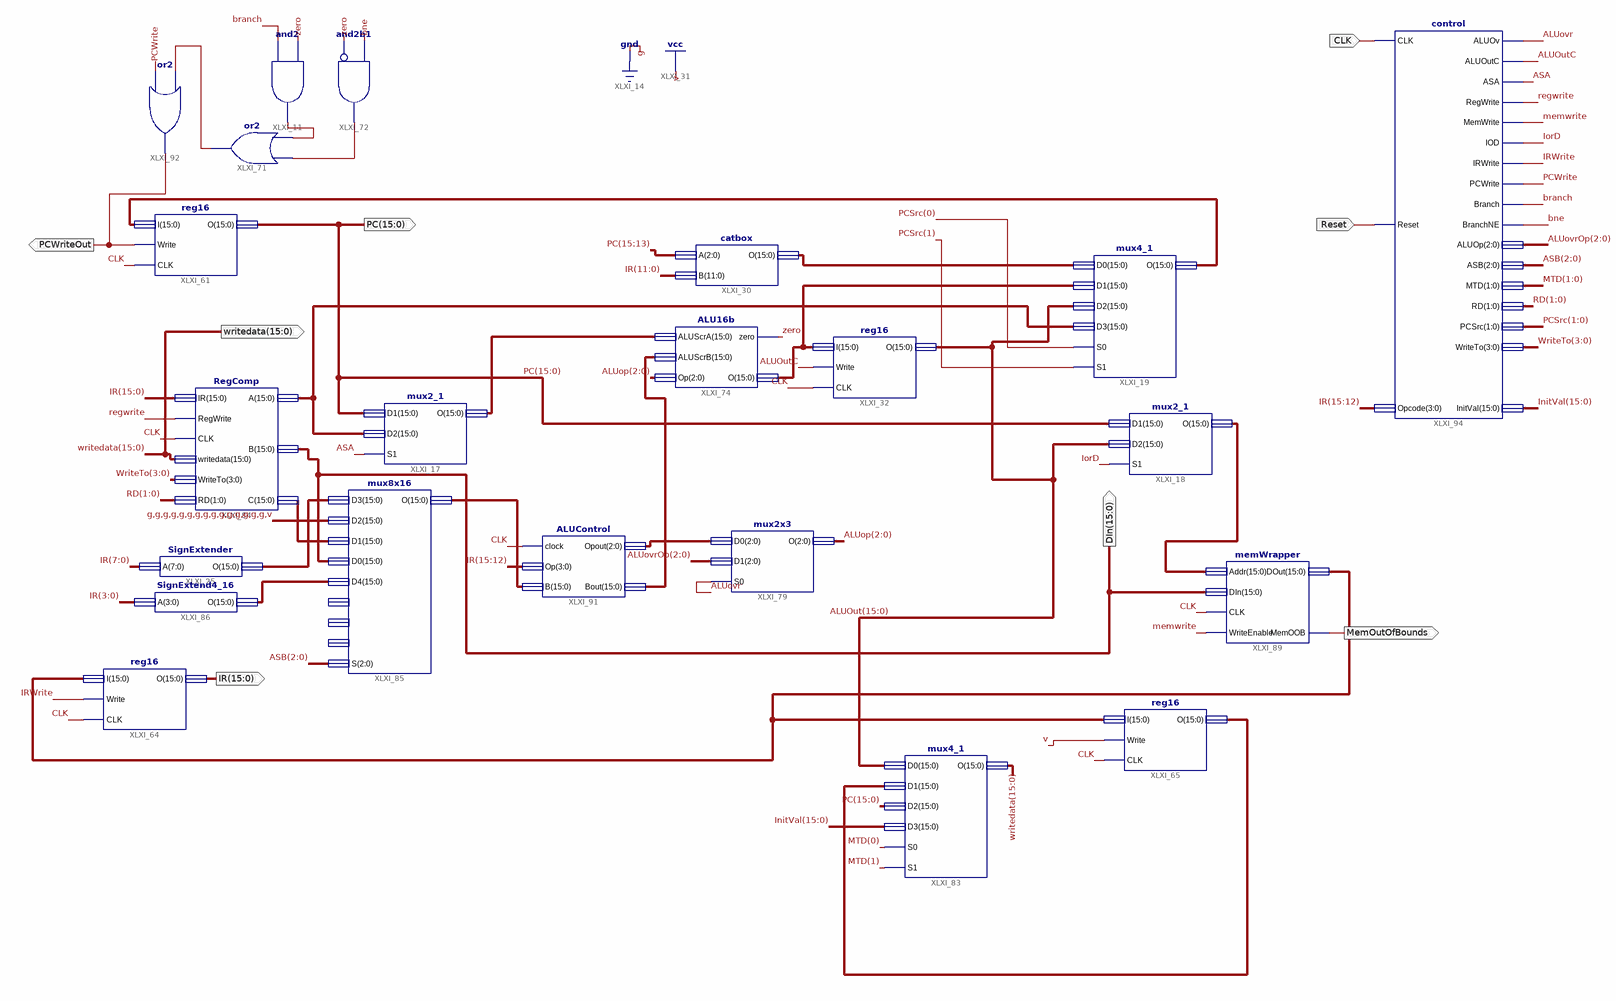
[diagram p0: schematic sheet 1]
// Xilinx ISE schematic FullDatapath.sch (spartan3e) as structural Verilog: 22 symbols, 8 ports
module FullDatapath (
  input  CLK,
  input  Reset,
  output [15:0] PC,
  output [15:0] writedata,
  output [15:0] IR,
  output PCWriteOut,
  output MemOutOfBounds,
  output [15:0] DIn
);

  wire ALUOutC, ALUovr, ASA, bne, branch, IorD, IRWrite, memwrite, PCWrite, regwrite, XLXN_331, XLXN_332,
       XLXN_333, zero;
  wire [1:0] MTD, PCSrc, RD;
  wire [2:0] ALUop, ALUovrOp, ASB, XLXN_426;
  wire [3:0] WriteTo;
  wire [15:0] ALUOut, InitVal, XLXN_1, XLXN_2, XLXN_7, XLXN_10, XLXN_37, XLXN_43, XLXN_150, XLXN_290,
       XLXN_294, XLXN_416, XLXN_452, XLXN_473, XLXN_474;

  and XLXI_11 (XLXN_331, branch, zero);
  mux4_1 XLXI_19 (.D0(XLXN_43), .D1(XLXN_474), .D2(ALUOut), .D3(XLXN_2), .S0(PCSrc[0]), .S1(PCSrc[1]), .O(XLXN_37));
  mux2_1 XLXI_18 (.D1(PC), .D2(ALUOut), .S1(IorD), .O(XLXN_150));
  mux2_1 XLXI_17 (.D1(PC), .D2(XLXN_2), .S1(ASA), .O(XLXN_1));
  SignExtender XLXI_25 (.A(IR[7:0]), .O(XLXN_473));
  reg16 XLXI_32 (.I(XLXN_474), .Write(ALUOutC), .CLK(CLK), .O(ALUOut));
  catbox XLXI_30 (.A(PC[15:13]), .B(IR[11:0]), .O(XLXN_43));
  reg16 XLXI_61 (.I(XLXN_37), .Write(PCWriteOut), .CLK(CLK), .O(PC));
  or XLXI_71 (XLXN_333, XLXN_331, XLXN_332);
  and XLXI_72 (XLXN_332, ~zero, bne);  // and2b1
  ALU16b XLXI_74 (.ALUScrA(XLXN_1), .ALUScrB(XLXN_416), .Op(ALUop), .zero(zero), .O(XLXN_474));
  reg16 XLXI_65 (.I(XLXN_290), .Write(1'b1), .CLK(CLK), .O(XLXN_294));
  mux2x3 XLXI_79 (.D0(XLXN_426), .D1(ALUovrOp), .S0(ALUovr), .O(ALUop));
  mux4_1 XLXI_83 (.D0(ALUOut), .D1(XLXN_294), .D2(PC), .D3(InitVal), .S0(MTD[0]), .S1(MTD[1]), .O(writedata));
  RegComp XLXI_84 (
    .IR(IR), .RegWrite(regwrite), .CLK(CLK), .writedata(writedata), .WriteTo(WriteTo), .RD(RD), .A(XLXN_2),
    .B(DIn), .C(XLXN_10));
  mux8x16 XLXI_85 (
    .D3(XLXN_473), .D2(16'b0000000000000001), .D1(XLXN_10), .D0(DIn), .D4(XLXN_452), .S(ASB), .O(XLXN_7));  // open: D5, D6, D7
  SignExtend4_16 XLXI_86 (.A(IR[3:0]), .O(XLXN_452));
  memWrapper XLXI_89 (
    .Addr(XLXN_150), .DIn(DIn), .CLK(CLK), .WriteEnable(memwrite), .DOut(XLXN_290), .MemOOB(MemOutOfBounds));
  ALUControl XLXI_91 (.clock(CLK), .Op(IR[15:12]), .B(XLXN_7), .Opout(XLXN_426), .Bout(XLXN_416));
  or XLXI_92 (PCWriteOut, PCWrite, XLXN_333);
  control XLXI_94 (
    .CLK(CLK), .Reset(Reset), .Opcode(IR[15:12]), .ALUOv(ALUovr), .ALUOutC(ALUOutC), .ASA(ASA),
    .RegWrite(regwrite), .MemWrite(memwrite), .IOD(IorD), .IRWrite(IRWrite), .PCWrite(PCWrite),
    .Branch(branch), .BranchNE(bne), .ALUOp(ALUovrOp), .ASB(ASB), .MTD(MTD), .RD(RD), .PCSrc(PCSrc),
    .WriteTo(WriteTo), .InitVal(InitVal));
  reg16 XLXI_64 (.I(XLXN_290), .Write(IRWrite), .CLK(CLK), .O(IR));
endmodule
